# EAGLE design untitled2 (EAGLE 7.2.0)
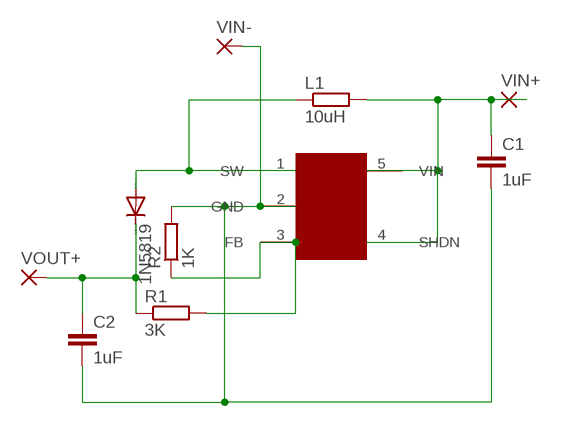
[diagram p0: schematic, sheet 1]

## Parts
1N5819  DIODE-DO214AC  [DO214AC]
C1  1uF  C-EUC1206  [C1206]
C2  1uF  C-EUC1206  [C1206]
L1  10uH  R-EU_R0805  [R0805]
R1  3K  R-EU_R1206  [R1206]
R2  1K  R-EU_R1206  [R1206]
U$8  AP3012  [SOT-23-5]
VIN+  SMD2  [SMD1,27-2,54]
VIN-  SMD2  [SMD1,27-2,54]
VOUT+  SMD2  [SMD1,27-2,54]

## Nets
N$1: 1N5819.A L1.1 U$8.1(SW)
N$2: C1.1 L1.2 U$8.4(SHDN) U$8.5(VIN) VIN+.1(P)
N$3: 1N5819.C C2.1 R1.1 VOUT+.1(P)
N$4: R1.2 R2.1 U$8.3(FB)
N$7: C1.2 C2.2 R2.2 U$8.2(GND) VIN-.1(P)

## Library data of the parts
1N5819 = diode:DIODE-: DIODE
C1 C2 = resistor:C-EU: CAPACITOR, European symbol
L1 R1 R2 = resistor:R-EU_: RESISTOR, European symbol
U$8 = smd-footprints:AP3012
VIN+ VIN- VOUT+ = wirepad:SMD2: SMD PAD

## Board
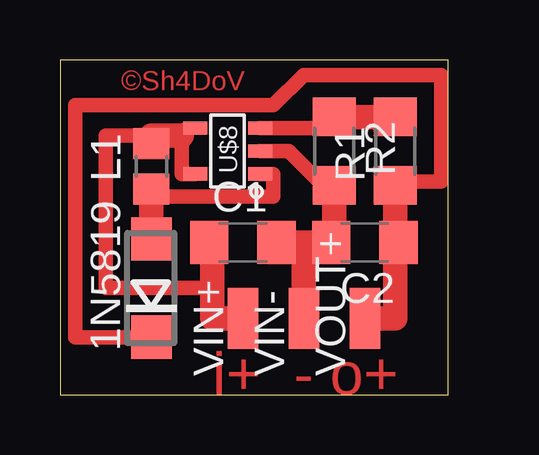
[diagram p1: board, top side]

Size 16.18 x 13.96 mm. Coordinates in mm from the lower left corner, seen from the top.
Outline: 0,0 16.18,0 16.18,13.96 0,13.96 0,0
Copper layers (1*16): Top 0.035mm / dielectric 1.5mm / Bottom 0.035mm
Design rules "default *": minimum track width 20mil, minimum drill 24mil, track to track 8mil, track to pad 8mil, pad to pad 8mil, via to via 8mil, smd to smd 8mil, copper to edge 40mil, drill to drill 8mil, minimum pad ring 10mil, minimum via ring 8mil, stop-mask expansion 4mil, vias tented up to drill 0mil, thermal gap 10mil

### Footprints (pad centres in the part's own frame; a part is rotated, then mirrored left to right if it is on the bottom)
DO214AC = smd 1.8 x 1.7: A 2.05,0; C -2.05,0
C1206 = smd 1.6 x 1.8: 1 -1.4,0; 2 1.4,0
R0805 = smd 1.3 x 1.5: 1 -0.95,0; 2 0.95,0
R1206 = smd 1.6 x 1.803: 1 -1.422,0; 2 1.422,0
SOT-23-5 = smd 1 x 0.55: 1 -1.35,0.95; 2 -1.35,0; 3 -1.35,-0.95; 4 1.35,-0.95; 5 1.35,0.95
SMD1,27-2,54 = smd 1.27 x 2.54: 1 0,0

### Placement (x,y rotation side)
1N5819  3.81,4.45 90 top
C1  7.62,6.35 0 top
C2  12.7,6.35 180 top
L1  3.81,9.53 90 top
R1  13.97,10.16 90 top
R2  11.43,10.16 270 top
U$8  6.98,10.16 180 top
VIN+  7.62,3.17 0 top
VIN-  10.16,3.17 0 top
VOUT+  12.7,3.17 0 top

### Tracks (layer width: path | path; a pad name or v marks a point on that pad's centre or on a via)
N$1
  Top 0.61: U$8.1 8.89,9.21 8.89,8.26 3.81,8.26 L1.1
  Top 1.016: 1N5819.A L1.1
N$2
  Top 0.406: 6.35,5.71 6.22,5.71 C1.1 | U$8.4 5.08,11.11 5.08,10.79
  Top 0.61: U$8.5 5.08,9.21 5.08,10.79 | 6.35,4.45 1.91,4.45 1.91,10.79 3.81,10.79
  Top 1.016: VIN+.1 6.35,3.17 6.35,4.45 6.35,5.71 | 5.08,10.79 3.81,10.79 L1.2
N$3
  Top 0.406: 13.97,5.71 14.1,5.71 C2.1 13.97,6.35
  Top 0.61: 1N5819.C 0.63,2.4 0.63,12.06 8.89,12.06 10.16,13.33 15.87,13.33 15.87,8.89 13.97,8.89 R1.1
  Top 1.016: VOUT+.1 13.97,3.17 13.97,5.71 | 13.97,6.35 R1.1
N$4
  Top 0.61: U$8.3 11.43,11.11 R2.1
  Top 1.016: R1.2 R2.1
N$7
  Top 0.406: R2.2 11.3,8.74
  Top 0.61: U$8.2 9.53,10.16 10.79,8.89 11.28,8.89 R2.2
  Top 1.016: VIN-.1 10.16,6.35 | 10.16,6.35 C1.2 | 10.16,6.35 C2.2 11.43,6.35 R2.2

### Text on the board
Top: ©Sh4DoV | i+ - o+